# Altium schematic sheet [01] - COVER PAGE.SchDoc
size Letter
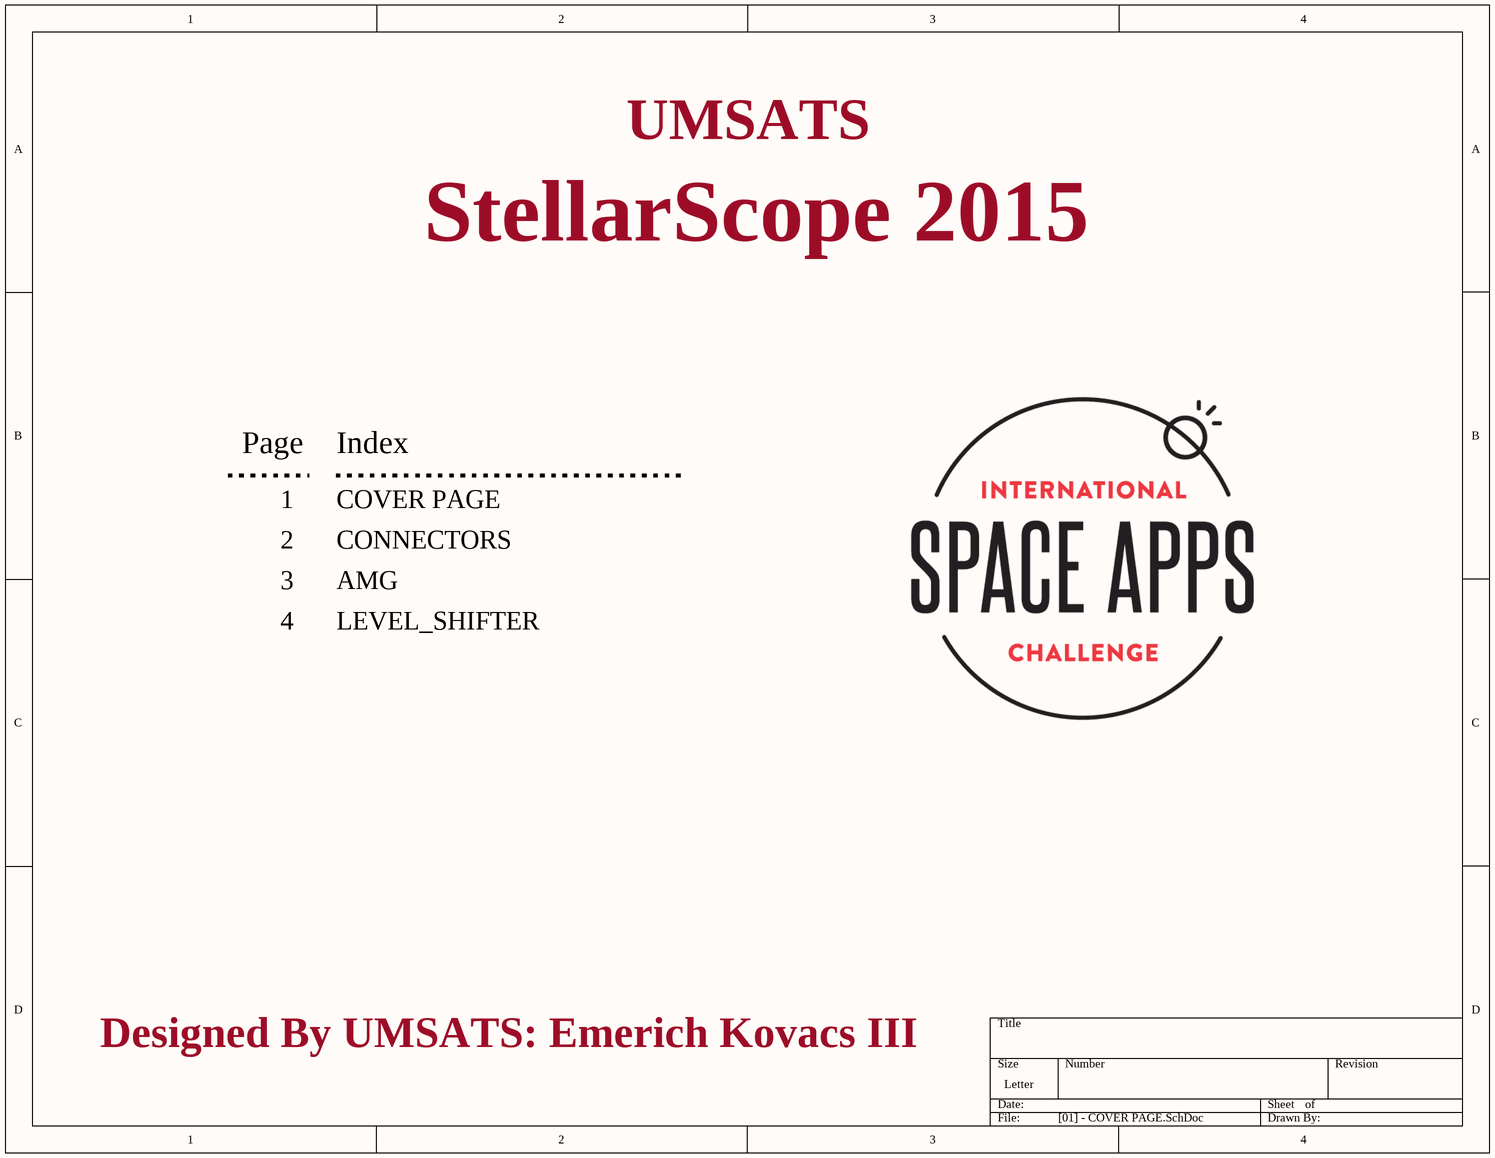
[diagram p0: [01] - COVER PAGE.SchDoc]

## Notes on the sheet
- UMSATS
- StellarScope 2015
- Page
- Index
- 1
- 2
- COVER PAGE
- CONNECTORS
- 3
- 4
- AMG
- LEVEL_SHIFTER
- Designed By UMSATS: Emerich Kovacs III